# Altium schematic sheet Sheet1.SchDoc
size 839 x 594 mm; ApprovedBy: .; CheckedBy: .; Author: Хасанов А.А; CompanyName: ЭПиУ 460; DrawnBy: .; Engineer: .; SheetNumber: 1; SheetTotal: 1; PageSetup: Record=PageOptions|CenterHorizontal=True|CenterVertical=True|PrintScale=0.94|XCorrection=1.00|YCorrection=1.00|PrintKind=1|BorderSize=5000000|LeftOffset=0|BottomOffset=0|Orientation=1|PaperLength=1000|PaperWidth=1000|Scale=100|PaperSource=7|PrintQuality=-4|MediaType=1|DitherType=10|PaperKind=A4|PrintScaleMode=1; DecimalNumber: ДП.11.02.14.460; HeadOfSector: .; MainDevice: Перв.примен.; Name: .; DocumentName: Sheet1.SCHDOC
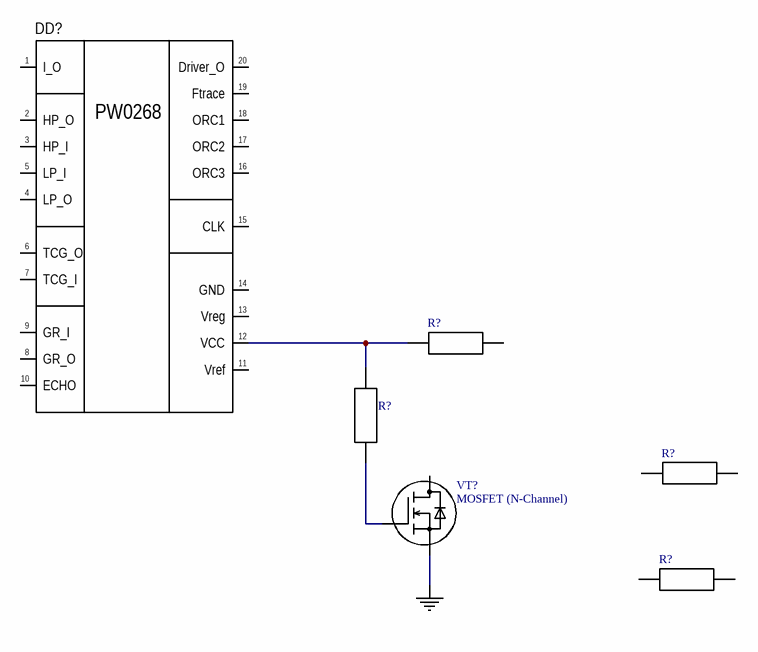
[diagram p0: Sheet1.SchDoc]

## Parts
(Parts that share a designator on the sheet are numbered #1, #2 ... from top to bottom, then left to right.)
DD?  PW0268  [TSSOP-20]  (value not drawn)
R?#1  resistor  [R0603]  (value not drawn)
R?#2  resistor  [R0603]  (value not drawn)
R?#3  resistor  [R0603]  (value not drawn)
R?#4  resistor  [R0603]  (value not drawn)
VT?  MOSFET (N-Channel)  [SOT-23-3]

## Nets
GND: VT?.1
NetDD?_12: DD?.12(VCC) R?#1.1 R?#2.2
NetR?#2_1: R?#2.1 VT?.2

Not connected (* = marked no-connect by the designer): DD? 1(I_O) 2(HP_O) 3(HP_I) 4(LP_O) 5(LP_I) 6(TCG_O) 7(TCG_I) 8(GR_O) 9(GR_I) 10(ECHO) 11(Vref) 13(Vreg) 14(GND) 15(CLK) 16(ORC3) 17(ORC2) 18(ORC1) 19(Ftrace) 20(Driver_O); R?#1 2; R?#3 1(5) 2; R?#4 1(5) 2; VT? 3(11)

## Notes on the sheet
- Перв.примен.
- Справ.№
- Подп. и дата
- Инв.№ дубл.
- Взам.инв.№
- Подп.и дата
- Разраб.
- Изм.
- Лист
- № докум.
- Подп.
- Дата
- Лит.
- Масштаб
- Масса
- Т.контр.
- Пров.
- СХЕМА   ЭЛЕКТРИЧЕСКАЯ
- ПРИНЦИПИАЛЬНАЯ
- Листов
- Инв.№ подл.
- Утв.
- Н.контр.
- Нач.сект.
- Формат  A1